# Altium project Prototipp_Mcu_Control Unit.PrjPcb
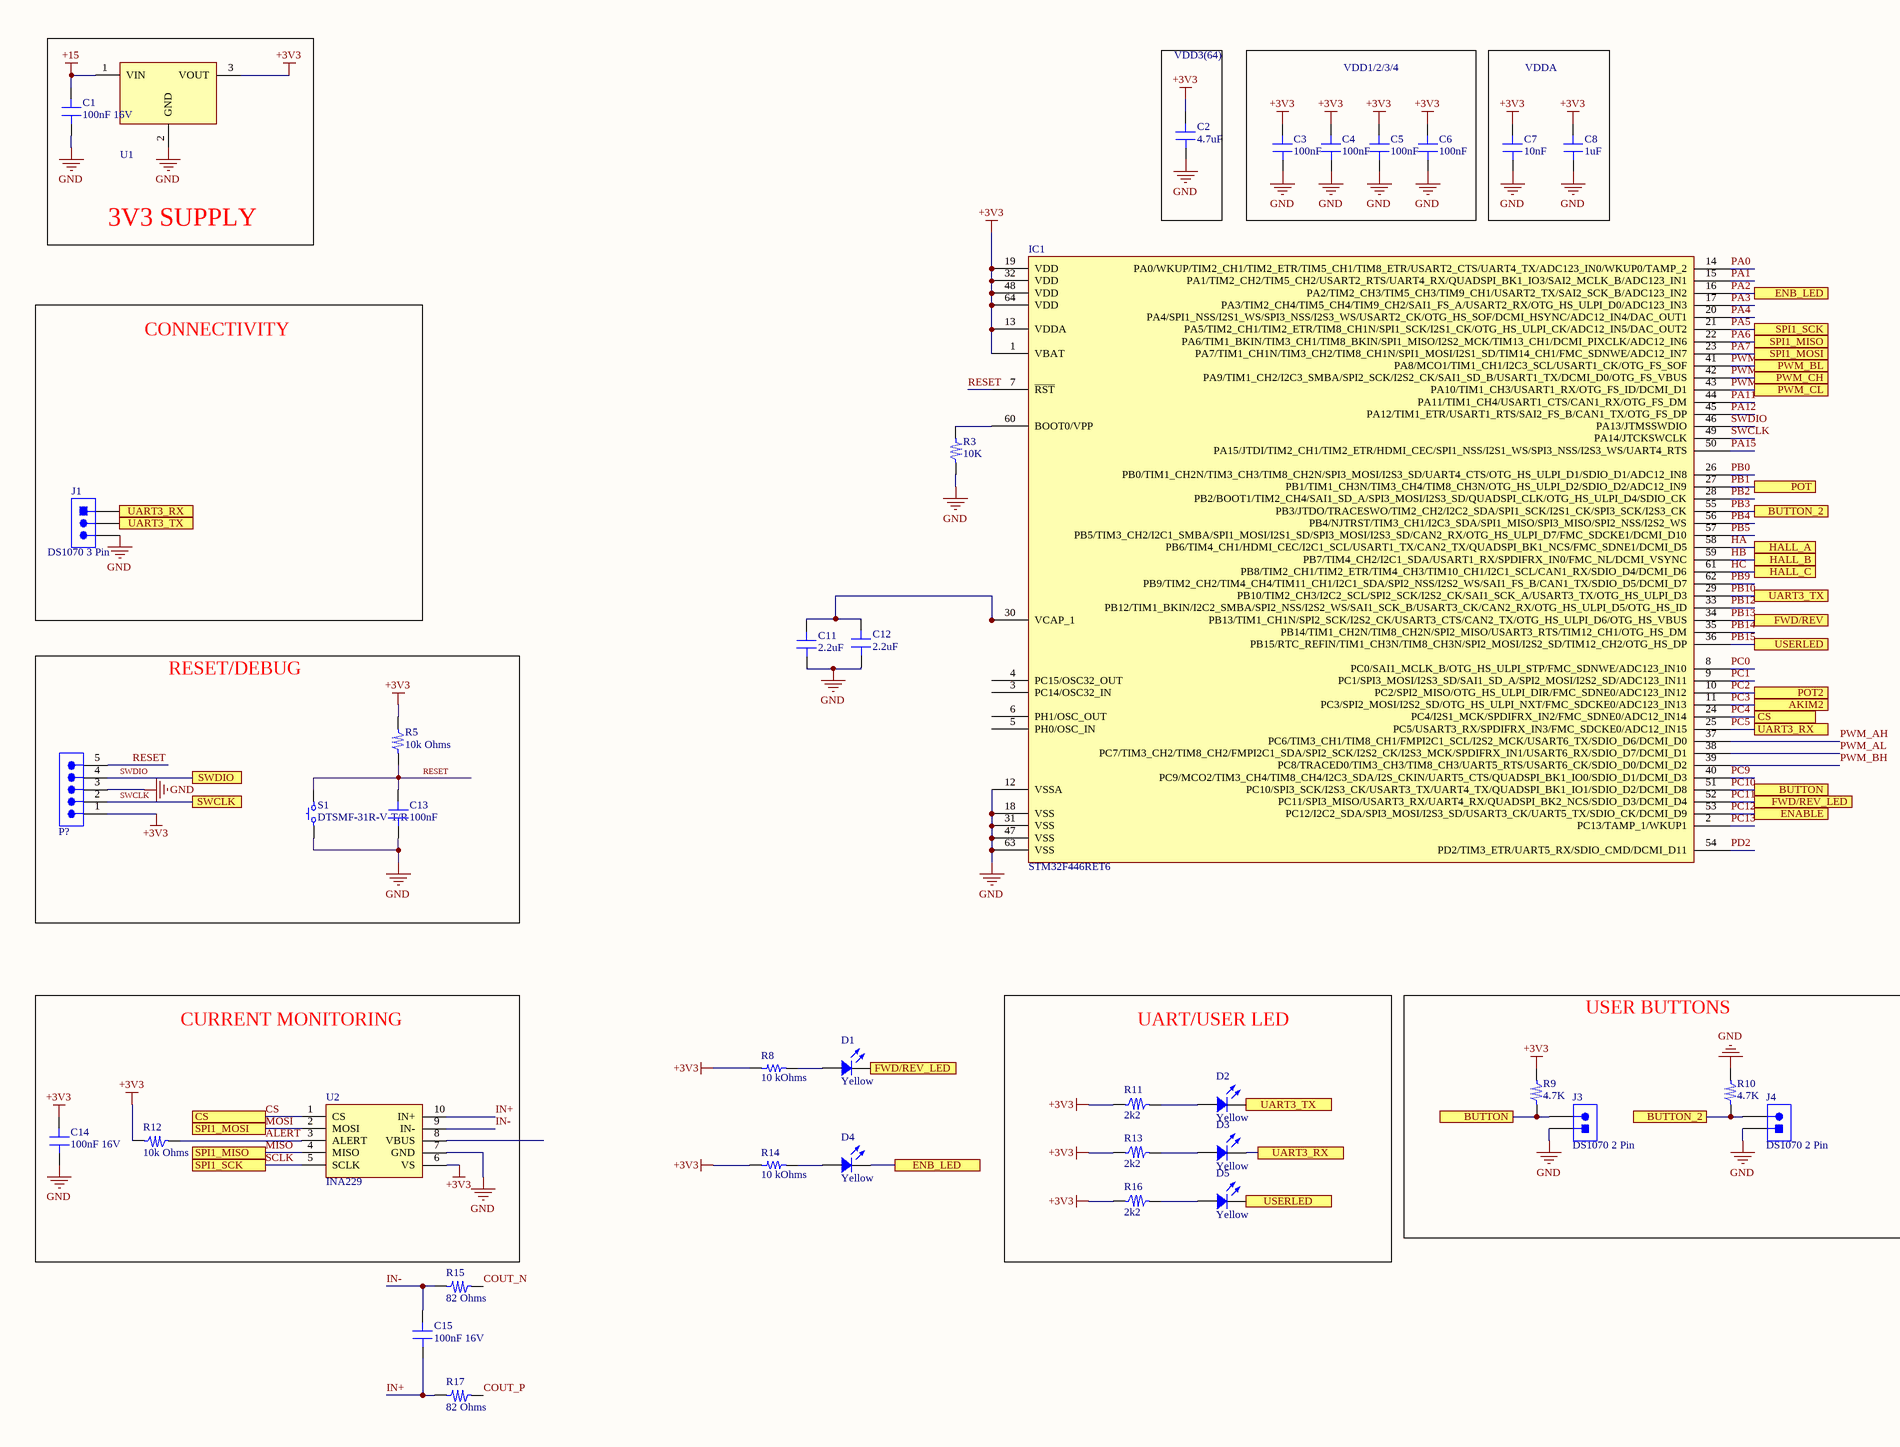
[diagram p0: Sheet2.SchDoc, left]
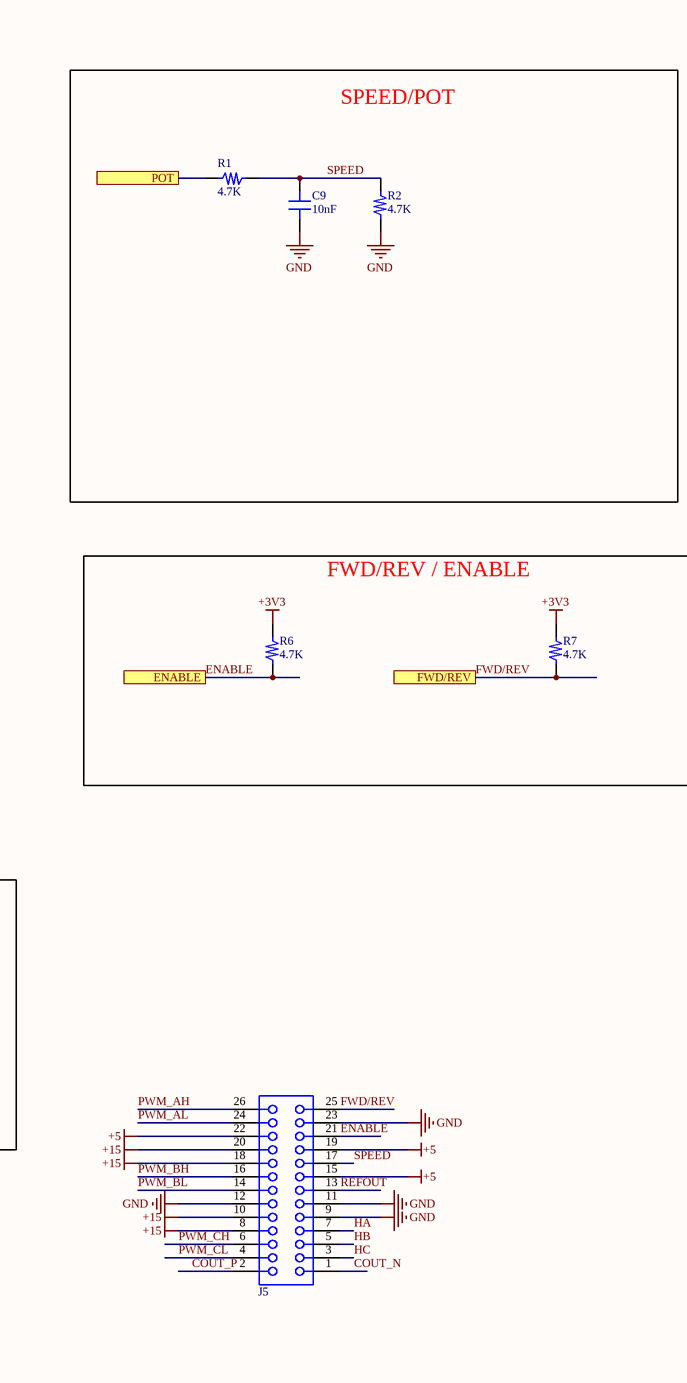
[diagram p1: Sheet2.SchDoc, right]
1 sheet, 44 parts. Net scope: flat (ports and power ports of the same name join across sheets).
Board file: PCB3.PcbDoc

## Sheet Sheet2.SchDoc
size A2; SheetNumber: 1; SheetTotal: 1

### Parts
C1  100nF 16V  [0805_CAP]
C2  4.7uF  [0603_CAP]
C3  100nF  [0603_CAP]
C4  100nF  [0603_CAP]
C5  100nF  [0603_CAP]
C6  100nF  [0603_CAP]
C7  10nF  [0603_CAP]
C8  1uF  [0603_CAP]
C9  10nF  [0603_CAP]
C11  2.2uF  [0603_CAP]
C12  2.2uF  [0603_CAP]
C13  100nF  [0603_CAP]
C14  100nF 16V  [0603_CAP]
C15  100nF 16V  [0603_CAP]
D1  Yellow  [LED 0603_1608 YELLOW]
D2  Yellow  [LED 0603_1608 YELLOW]
D3  Yellow  [LED 0603_1608 YELLOW]
D4  Yellow  [LED 0603_1608 YELLOW]
D5  Yellow  [LED 0603_1608 YELLOW]
IC1  STM32F446RET6  [ST LQFP-64 10X10MM]
J1  DS1070 3 Pin  [3pin_100mil]
J3  DS1070 2 Pin  [2PIN_100mil]
J4  DS1070 2 Pin  [2PIN_100mil]
J5  61302621821  [61302621821]  (value not drawn)
P?  61300511121  [61300511121]  (value not drawn)
R1  4.7K  [0603_RES]
R2  4.7K  [0603_RES]
R3  10K  [0603_RES]
R5  10k Ohms  [0805_RES]
R6  4.7K  [0603_RES]
R7  4.7K  [0603_RES]
R8  10 kOhms  [RES 0603_1608]
R9  4.7K  [0603_RES]
R10  4.7K  [0603_RES]
R11  2k2  [0603_RES]
R12  10k Ohms  [0603_RES]
R13  2k2  [0603_RES]
R14  10 kOhms  [RES 0603_1608]
R15  82 Ohms  [0603_RES]
R16  2k2  [0603_RES]
R17  82 Ohms  [0603_RES]
S1  DTSMF-31R-V-T/R  [Button]
U1  7-28Vin, 3.3Vout, 1Aout  [WPME-FDSM_SIP-3_L11.6W8.5H10.5]  (value not drawn)
U2  INA229  [INA229]

### Blocks framed on the sheet
3V3 SUPPLY: C1 U1
VDD3(64): C2
VDD1/2/3/4: C3-C6
VDDA: C7 C8
SPEED/POT: C9 R1 R2
CONNECTIVITY: J1
RESET/DEBUG: C13 P? R5 S1
FWD/REV / ENABLE: R6 R7
CURRENT MONITORING: C14 R12 U2
UART/USER LED: D2 D3 D5 R11 R13 R16
USER BUTTONS: J3 J4 R9 R10

### Ports
AKIM2, BUTTON, BUTTON_2, CS, ENABLE, ENB_LED, FWD/REV, FWD/REV_LED, HALL_A, HALL_B, HALL_C, POT, POT2, PWM_BL, PWM_CH, PWM_CL, SPI1_MISO, SPI1_MOSI, SPI1_SCK, SWCLK, SWDIO, UART3_RX, UART3_TX, USERLED

### Nets
+3V3: C2.1 C3.1 C4.1 C5.1 C6.1 C7.1 C8.1 C14.2 IC1.1(VBAT) IC1.13(VDDA) IC1.19(VDD) IC1.32(VDD) IC1.48(VDD) IC1.64(VDD) P?.1 R5.2 R6.2 R7.2 R8.1 R9.2 R11.1 R12.2 R13.1 R14.1 R16.1 U1.3(VOUT) U2.6(VS)
+5: J5.15 J5.19 J5.22
+15: C1.2 J5.8 J5.10 J5.18 J5.20 U1.1(VIN)
GND: C1.1 C2.2 C3.2 C4.2 C5.2 C6.2 C7.2 C8.2 C9.2 C11.2 C12.2 C13.2 C14.1 IC1.12(VSSA) IC1.18(VSS) IC1.31(VSS) IC1.47(VSS) IC1.63(VSS) J1.3 J3.1 J4.1 J5.9 J5.11 J5.12 J5.23 P?.3 R2.1 R3.2 R10.2 S1.1 U1.2(GND) U2.7(GND)
ALERT: R12.1 U2.3(ALERT)
COUT_N: J5.1 R15.1
COUT_P: J5.2 R17.1
CS: IC1.24(PC4/I2S1_MCK/SPDIFRX_IN2/FMC_SDNE0/ADC12_IN14) U2.1(CS) ; port CS  [also labelled PC4]
ENABLE: IC1.53(PC12/I2C2_SDA/SPI3_MOSI/I2S3_SD/USART3_CK/UART5_TX/SDIO_CK/DCMI_D9) J5.21 R6.1 ; port ENABLE  [also labelled PC12]
FWD/REV: IC1.34(PB13/TIM1_CH1N/SPI2_SCK/I2S2_CK/USART3_CTS/CAN2_TX/OTG_HS_ULPI_D6/OTG_HS_VBUS) J5.25 R7.1 ; port FWD/REV  [also labelled PB13]
HA: IC1.58(PB6/TIM4_CH1/HDMI_CEC/I2C1_SCL/USART1_TX/CAN2_TX/QUADSPI_BK1_NCS/FMC_SDNE1/DCMI_D5) J5.7 ; port HALL_A
HB: IC1.59(PB7/TIM4_CH2/I2C1_SDA/USART1_RX/SPDIFRX_IN0/FMC_NL/DCMI_VSYNC) J5.5 ; port HALL_B
HC: IC1.61(PB8/TIM2_CH1/TIM2_ETR/TIM4_CH3/TIM10_CH1/I2C1_SCL/CAN1_RX/SDIO_D4/DCMI_D6) J5.3 ; port HALL_C
IN+: C15.1 R17.2 U2.10(IN+)
IN-: C15.2 R15.2 U2.9(IN-)
MISO: IC1.22(PA6/TIM1_BKIN/TIM3_CH1/TIM8_BKIN/SPI1_MISO/I2S2_MCK/TIM13_CH1/DCMI_PIXCLK/ADC12_IN6) U2.4(MISO) ; port SPI1_MISO  [also labelled PA6]
MOSI: IC1.23(PA7/TIM1_CH1N/TIM3_CH2/TIM8_CH1N/SPI1_MOSI/I2S1_SD/TIM14_CH1/FMC_SDNWE/ADC12_IN7) U2.2(MOSI) ; port SPI1_MOSI  [also labelled PA7]
PA0: IC1.14(PA0/WKUP/TIM2_CH1/TIM2_ETR/TIM5_CH1/TIM8_ETR/USART2_CTS/UART4_TX/ADC123_IN0/WKUP0/TAMP_2)
PA1: IC1.15(PA1/TIM2_CH2/TIM5_CH2/USART2_RTS/UART4_RX/QUADSPI_BK1_IO3/SAI2_MCLK_B/ADC123_IN1)
PA2: D4.2 IC1.16(PA2/TIM2_CH3/TIM5_CH3/TIM9_CH1/USART2_TX/SAI2_SCK_B/ADC123_IN2) ; port ENB_LED
PA3: IC1.17(PA3/TIM2_CH4/TIM5_CH4/TIM9_CH2/SAI1_FS_A/USART2_RX/OTG_HS_ULPI_D0/ADC123_IN3)
PA4: IC1.20(PA4/SPI1_NSS/I2S1_WS/SPI3_NSS/I2S3_WS/USART2_CK/OTG_HS_SOF/DCMI_HSYNC/ADC12_IN4/DAC_OUT1)
PA5: IC1.21(PA5/TIM2_CH1/TIM2_ETR/TIM8_CH1N/SPI1_SCK/I2S1_CK/OTG_HS_ULPI_CK/ADC12_IN5/DAC_OUT2) U2.5(SCLK) ; port SPI1_SCK  [also labelled SCLK]
PA11: IC1.44(PA11/TIM1_CH4/USART1_CTS/CAN1_RX/OTG_FS_DM)
PA12: IC1.45(PA12/TIM1_ETR/USART1_RTS/SAI2_FS_B/CAN1_TX/OTG_FS_DP)
PA15: IC1.50(PA15/JTDI/TIM2_CH1/TIM2_ETR/HDMI_CEC/SPI1_NSS/I2S1_WS/SPI3_NSS/I2S3_WS/UART4_RTS)
PB0: IC1.26(PB0/TIM1_CH2N/TIM3_CH3/TIM8_CH2N/SPI3_MOSI/I2S3_SD/UART4_CTS/OTG_HS_ULPI_D1/SDIO_D1/ADC12_IN8)
PB1: IC1.27(PB1/TIM1_CH3N/TIM3_CH4/TIM8_CH3N/OTG_HS_ULPI_D2/SDIO_D2/ADC12_IN9) R1.2 ; port POT
PB2: IC1.28(PB2/BOOT1/TIM2_CH4/SAI1_SD_A/SPI3_MOSI/I2S3_SD/QUADSPI_CLK/OTG_HS_ULPI_D4/SDIO_CK)
PB3: IC1.55(PB3/JTDO/TRACESWO/TIM2_CH2/I2C2_SDA/SPI1_SCK/I2S1_CK/SPI3_SCK/I2S3_CK) J4.2 R10.1 ; port BUTTON_2
PB4: IC1.56(PB4/NJTRST/TIM3_CH1/I2C3_SDA/SPI1_MISO/SPI3_MISO/SPI2_NSS/I2S2_WS)
PB5: IC1.57(PB5/TIM3_CH2/I2C1_SMBA/SPI1_MOSI/I2S1_SD/SPI3_MOSI/I2S3_SD/CAN2_RX/OTG_HS_ULPI_D7/FMC_SDCKE1/DCMI_D10)
PB9: IC1.62(PB9/TIM2_CH2/TIM4_CH4/TIM11_CH1/I2C1_SDA/SPI2_NSS/I2S2_WS/SAI1_FS_B/CAN1_TX/SDIO_D5/DCMI_D7)
PB10: D2.2 IC1.29(PB10/TIM2_CH3/I2C2_SCL/SPI2_SCK/I2S2_CK/SAI1_SCK_A/USART3_TX/OTG_HS_ULPI_D3) J1.2 ; port UART3_TX
PB12: IC1.33(PB12/TIM1_BKIN/I2C2_SMBA/SPI2_NSS/I2S2_WS/SAI1_SCK_B/USART3_CK/CAN2_RX/OTG_HS_ULPI_D5/OTG_HS_ID)
PB14: IC1.35(PB14/TIM1_CH2N/TIM8_CH2N/SPI2_MISO/USART3_RTS/TIM12_CH1/OTG_HS_DM)
PB15: D5.2 IC1.36(PB15/RTC_REFIN/TIM1_CH3N/TIM8_CH3N/SPI2_MOSI/I2S2_SD/TIM12_CH2/OTG_HS_DP) ; port USERLED
PC0: IC1.8(PC0/SAI1_MCLK_B/OTG_HS_ULPI_STP/FMC_SDNWE/ADC123_IN10)
PC1: IC1.9(PC1/SPI3_MOSI/I2S3_SD/SAI1_SD_A/SPI2_MOSI/I2S2_SD/ADC123_IN11)
PC2: IC1.10(PC2/SPI2_MISO/OTG_HS_ULPI_DIR/FMC_SDNE0/ADC123_IN12) ; port POT2
PC3: IC1.11(PC3/SPI2_MOSI/I2S2_SD/OTG_HS_ULPI_NXT/FMC_SDCKE0/ADC123_IN13) ; port AKIM2
PC5: D3.2 IC1.25(PC5/USART3_RX/SPDIFRX_IN3/FMC_SDCKE0/ADC12_IN15) J1.1 ; port UART3_RX
PC9: IC1.40(PC9/MCO2/TIM3_CH4/TIM8_CH4/I2C3_SDA/I2S_CKIN/UART5_CTS/QUADSPI_BK1_IO0/SDIO_D1/DCMI_D3)
PC10: IC1.51(PC10/SPI3_SCK/I2S3_CK/USART3_TX/UART4_TX/QUADSPI_BK1_IO1/SDIO_D2/DCMI_D8) J3.2 R9.1 ; port BUTTON
PC11: D1.2 IC1.52(PC11/SPI3_MISO/USART3_RX/UART4_RX/QUADSPI_BK2_NCS/SDIO_D3/DCMI_D4) ; port FWD/REV_LED
PC13: IC1.2(PC13/TAMP_1/WKUP1)
PD2: IC1.54(PD2/TIM3_ETR/UART5_RX/SDIO_CMD/DCMI_D11)
PWM_AH: IC1.37(PC6/TIM3_CH1/TIM8_CH1/FMPI2C1_SCL/I2S2_MCK/USART6_TX/SDIO_D6/DCMI_D0) J5.26
PWM_AL: IC1.38(PC7/TIM3_CH2/TIM8_CH2/FMPI2C1_SDA/SPI2_SCK/I2S2_CK/I2S3_MCK/SPDIFRX_IN1/USART6_RX/SDIO_D7/DCMI_D1) J5.24
PWM_BH: IC1.39(PC8/TRACED0/TIM3_CH3/TIM8_CH3/UART5_RTS/USART6_CK/SDIO_D0/DCMI_D2) J5.16
PWM_BL: IC1.41(PA8/MCO1/TIM1_CH1/I2C3_SCL/USART1_CK/OTG_FS_SOF) J5.14 ; port PWM_BL
PWM_CH: IC1.42(PA9/TIM1_CH2/I2C3_SMBA/SPI2_SCK/I2S2_CK/SAI1_SD_B/USART1_TX/DCMI_D0/OTG_FS_VBUS) J5.6 ; port PWM_CH
PWM_CL: IC1.43(PA10/TIM1_CH3/USART1_RX/OTG_FS_ID/DCMI_D1) J5.4 ; port PWM_CL
REFOUT: J5.13
RESET: C13.1 IC1.7(~{RST}) P?.5 R5.1 S1.2
SPEED: C9.1 J5.17 R1.1 R2.2
SWCLK: IC1.49(PA14/JTCKSWCLK) P?.2 ; port SWCLK
SWDIO: IC1.46(PA13/JTMSSWDIO) P?.4 ; port SWDIO
NetC11_1: C11.1 C12.1 IC1.30(VCAP_1)
NetD1_1: D1.1 R8.2
NetD2_1: D2.1 R11.2
NetD3_1: D3.1 R13.2
NetD4_1: D4.1 R14.2
NetD5_1: D5.1 R16.2
NetIC1_60: IC1.60(BOOT0/VPP) R3.1

Not connected (* = marked no-connect by the designer): IC1 3(PC14/OSC32_IN) 4(PC15/OSC32_OUT) 5(PH0/OSC_IN) 6(PH1/OSC_OUT); U2 8(VBUS)

### Library data of the parts
C1 = CAP_0805: Value: 100nF 16V
C2-C8 C11-C13 = CAP_0603: CL10B105KO8NNNC - MLCC (1608) 0603 1uF 16VDC ±10% X7R; Value: 1uF 16V
C9 = CAP_0603: CL10B105KO8NNNC - MLCC (1608) 0603 1uF 16VDC ±10% X7R; Value: 100nF 16V
C14 C15 = CAP_0603: CL10B105KO8NNNC - MLCC (1608) 0603 1uF 16VDC ±10% X7R; Value: 100nF 16V
D1-D5 = BL-HKC36D-AV-TRB: 0603 YELLOW; Manufacturer: American Bright Optoelectronics Corporation; Configuration: 0603; Current - Test: 20mA; Lens Color: Colorless; Lens Size: 0.87mm x 0.80mm; Lens Style: Rectangle with Flat Top; Lens Transparency: Clear; Millicandela Rating: 120mcd; Viewing Angle: 120°; Voltage - Forward (Vf) (Typ): 2V; Wavelength - Dominant: 589nm; Wavelength - Peak: 590nm; Part Number: BL-HKC36D-AV-TRB; Color: Yellow; ComponentLink1Description: Datasheet; ComponentLink1URL: http://americanbrightled.com/pdffiles/smt/BL-HKC36D-AV-TRB.pdf; ComponentLink2Description: DigiKey Link; ComponentLink2URL: https://www.digikey.com/en/products/detail/american-bright-optoelectronics-corporation/BL-HKC36D-AV-TRB/9678175; Device Package: 0603 (1608 Metric); Height (Max): 0.85mm; LastUpdated: 30.01.2024 21:34:20; Lifecycle Status: Active; Minimum Order: 1; Mounting Type: Surface Mount; Package / Case: 0603 (1608 Metric); Packaging: TapeAndReel; PartId: 82; Part Status: Active; Price: 0.04; Series: -; Size / Dimension: 1.60mm L x 0.80mm W; Supplier 1: DigiKey; Supplier Part Number 1: BL-HKC36D-AV-TRBCT-ND; Supplier Device Package: 0603; Value: Yellow
IC1 = STM32F446RET6: IC MCU 32BIT 512KB FLASH 64LQFP; Manufacturer: STMicroelectronics; Connectivity: CANbus, EBI/EMI, I²C, IrDA, LINbus, SAI, SD, SPDIF-Rx, SPI, UART/USART, USB, USB OTG; Core Processor: ARM® Cortex®-M4; Core Size: 32-Bit Single-Core; Data Converters: A/D 16x12b; D/A 2x12b; Number of I/O: 50; Oscillator Type: Internal; Peripherals: Brown-out Detect/Reset, DMA, I²S, LVD, POR, PWM, WDT; Program Memory Size: 512KB (512K x 8); RAM Size: 128K x 8; Speed: 180MHz; Voltage - Supply (Vcc/Vdd): 1.7V ~ 3.6V; Part Number: STM32F446RET6; ComponentLink1Description: Datasheet; ComponentLink1URL: http://www.st.com/content/ccc/resource/technical/document/datasheet/65/cb/75/50/53/d6/48/24/DM00141306.pdf/files/DM00141306.pdf/jcr:content/translations/en.DM00141306.pdf; ComponentLink2Description: DigiKey Link; ComponentLink2URL: https://www.digikey.com/en/products/detail/stmicroelectronics/STM32F446RET6/5175962; LastUpdated: 27.01.2024 21:31:11; Lifecycle Status: Active; Minimum Order: 1; Mounting Type: Surface Mount; Operating Temperature: -40°C ~ 85°C (TA); Package / Case: 64-LQFP; Packaging: Tray; PartId: 121; Part Status: Active; Price: 6.95; Program Memory Type: FLASH; Series: STM32F4; Supplier 1: DigiKey; Supplier Part Number 1: 497-15376-ND; Supplier Device Package: 64-LQFP (10x10)
J1 = 3 Pin Socket: 3 Pin 100mm Connector; ComponentLink1Description: Özdisan; ComponentLink1URL: https://www.ozdisan.com/konnektor-ve-baglanti-elemanlari/konnektor-cesitleri/pcb-konnektorler/DS1070-3MVV6; Part: DS1070 3 Pin
J3 J4 = 2 Pin Socket: 2pin Socket 100mil
J5 = 61302621821: WR-PHD Socket Header, THT, Vertical, pitch 2.54mm, 2 Row, 26P; Manufacturer: Wurth Elektronik; Contact Resistance: 20mΩ; Rated Current: 3A; Working Voltage: 250V; Withstanding Voltage: 500V; ComponentLink1Description: Website Link; ComponentLink1URL: https://www.we-online.com/redexpert/article/61302621821?ad; ComponentLink2Description: Datasheet Link; ComponentLink2URL: https://www.we-online.com/redexpert/spec/61302621821?ad; Manufacturer Part Number: 61302621821; Category: Board-to-Board Connectors; Match Code: WR-PHD; Mount: Through Hole; Operating Temperature Max: 125°C; Operating Temperature Min: -40°C; Packaging: Tray; Gender: Socket Header; Number of Pins: 26; Number of Rows: 2; Orientation: Vertical; Pitch: 2.54mm
P? = 61300511121: WR-PHD Pin Header, THT, Vertical, pitch 2.54mm, 1 Row, 5P; Manufacturer: Wurth Elektronik; Contact Resistance: 20mΩ; Rated Current: 3A; Working Voltage: 250V; Withstanding Voltage: 500V; ComponentLink1Description: Website Link; ComponentLink1URL: https://www.we-online.com/redexpert/article/61300511121?ad; ComponentLink2Description: Datasheet Link; ComponentLink2URL: https://www.we-online.com/redexpert/spec/61300511121?ad; Manufacturer Part Number: 61300511121; Category: Board-to-Board Connectors; Match Code: WR-PHD; Mount: Through Hole; Operating Temperature Max: 105°C; Operating Temperature Min: -40°C; Packaging: Bag; Gender: Pin Header; Number of Pins: 5; Number of Rows: 1; Orientation: Vertical; Pitch: 2.54mm
R1-R3 R6 R7 R9-R11 R13 R16 = RES_0603: 0603; Value: 0/10 Ohms; Power: 1/8W
R5 = RES_0805: 0805; Power: 1/8 W; Value: 10k Ohms
R8 R14 = RNCS0603BKE10K0: RES 10K OHM 0.1% 1/16W 0603; Manufacturer: Stackpole Electronics Inc; Power (Watts): 0.063W, 1/16W; Temperature Coefficient: ±25ppm/°C; Part Number: RNCS0603BKE10K0; Value: 10 kOhms; ComponentLink1Description: Datasheet; ComponentLink1URL: https://www.seielect.com/catalog/sei-rncs_rnch.pdf; ComponentLink2Description: DigiKey Link; ComponentLink2URL: https://www.digikey.com/en/products/detail/stackpole-electronics-inc/RNCS0603BKE10K0/1708836; Composition: Thin Film; Device Package: 0603 (1608 Metric); Features: Anti-Corrosive, Automotive AEC-Q200, Moisture Resistant; Height - Seated (Max): 0.022" (0.55mm); LastUpdated: 28.01.2024 20:40:01; Lifecycle Status: Active; Minimum Order: 1; Number of Terminations: 2; Operating Temperature: -55°C ~ 155°C; Package / Case: 0603 (1608 Metric); Packaging: TapeAndReel; PartId: 4838; Part Status: Active; Price: 0.06; Ratings: AEC-Q200; Resistance: 10 kOhms; Series: RNCS; Size / Dimension: 0.061" L x 0.031" W (1.55mm x 0.80mm); Supplier 1: DigiKey; Supplier Part Number 1: RNCS0603BKE10K0CT-ND; Supplier Device Package: 0603; Tolerance: ±0.1%
R12 R15 R17 = RES_0603: 0603; Power: 1/8W
  R12: Value: 10k Ohms
  R15 R17: Value: 82 Ohms
S1 = DTSMF-31R-V-T/R: DTSMF-31R-V-T/R - SWITCH TACT 6.00x3.50 4.30mm 260gF SMT V/T; ComponentLink1Description: özdisan; ComponentLink1URL: https://ozdisan.com/elektromekanik-komponentler/sivicler-ve-anahtarlar/tact-sivicler/DTSMF-31R-V-TR
U1 = 173010378: WPME-FDSM Fixed Step Down Regulator Module, THT, SIP-3, 7-28Vin, 3.3Vout, 1Aout; Manufacturer: Wurth Elektronik; Input Voltage Min: 7V; Input Voltage Max: 28V; Output Current: 1A; Output Voltage: 3.3V; Manufacturer Part Number: 173010378; Category: Step Down Converter; Match Code: WPME-FDSM; ComponentLink1Description: Website Link; ComponentLink1URL: https://www.we-online.com/redexpert/article/173010378?ad; ComponentLink2Description: Datasheet Link; ComponentLink2URL: https://www.we-online.com/redexpert/spec/173010378?ad; Mount: Through Hole; Operating Temperature Max: 85°C; Operating Temperature Min: -40°C; Packaging: Tube; Case/Size Code: SIP-3; Length: 11.6mm; Width: 8.5mm; Height: 10.5mm